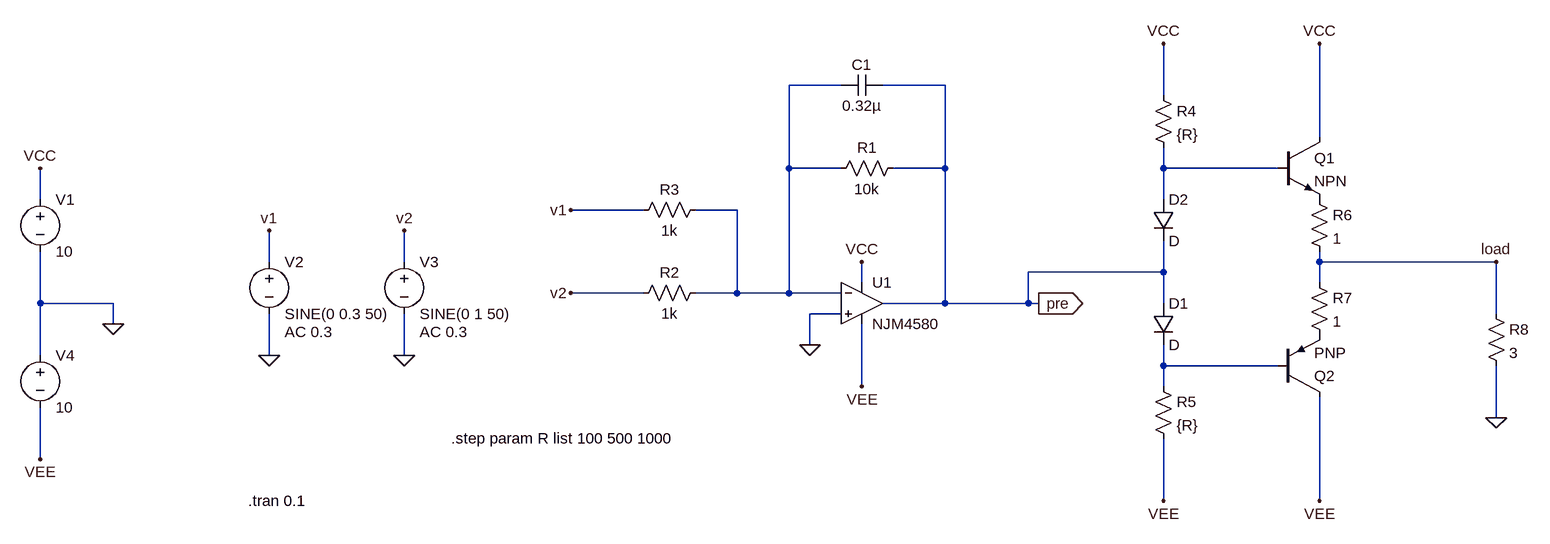
[diagram p0: schematic woofer_amp_coupling_capacitor.asc]
woofer_amp_coupling_capacitor.asc, the LTspice schematic file:
Version 4
SHEET 1 1160 680
WIRE 96 -192 16 -192
WIRE 256 -192 160 -192
WIRE 592 -176 592 -256
WIRE 832 -112 832 -256
WIRE 16 -64 16 -192
WIRE 96 -64 16 -64
WIRE 256 -64 256 -192
WIRE 256 -64 176 -64
WIRE 592 -64 592 -96
WIRE 768 -64 592 -64
WIRE -1136 -16 -1136 -64
WIRE 592 -16 592 -64
WIRE -208 0 -320 0
WIRE -64 0 -128 0
WIRE -784 80 -784 32
WIRE -576 80 -576 32
WIRE 832 80 832 64
WIRE 1104 80 832 80
WIRE 592 96 592 48
WIRE 592 96 384 96
WIRE 128 112 128 80
WIRE 832 112 832 80
WIRE -208 128 -320 128
WIRE -64 128 -64 0
WIRE -64 128 -128 128
WIRE 16 128 16 -64
WIRE 16 128 -64 128
WIRE 96 128 16 128
WIRE -1136 144 -1136 64
WIRE -1024 144 -1136 144
WIRE 256 144 256 -64
WIRE 256 144 160 144
WIRE 384 144 384 96
WIRE 384 144 256 144
WIRE 400 144 384 144
WIRE 592 144 592 96
WIRE 96 160 48 160
WIRE 1104 160 1104 80
WIRE -1024 176 -1024 144
WIRE 48 208 48 160
WIRE -1136 224 -1136 144
WIRE -784 224 -784 160
WIRE -576 224 -576 160
WIRE 592 240 592 208
WIRE 768 240 592 240
WIRE 128 272 128 176
WIRE 592 272 592 240
WIRE 1104 320 1104 240
WIRE -1136 384 -1136 304
WIRE 592 448 592 352
WIRE 832 448 832 288
FLAG 48 208 0
FLAG 400 144 pre
IOPIN 400 144 Out
FLAG -1136 -64 VCC
FLAG -1136 384 VEE
FLAG 128 80 VCC
FLAG 128 272 VEE
FLAG -784 32 v1
FLAG -576 32 v2
FLAG -576 224 0
FLAG -784 224 0
FLAG -320 0 v1
FLAG -320 128 v2
FLAG -1024 176 0
FLAG 592 -256 VCC
FLAG 592 448 VEE
FLAG 832 448 VEE
FLAG 832 -256 VCC
FLAG 1104 320 0
FLAG 1104 80 load
SYMBOL Opamps\\NJM4580 128 80 R0
SYMATTR InstName U1
SYMBOL cap 160 -208 R90
WINDOW 0 0 32 VBottom 2
WINDOW 3 32 32 VTop 2
SYMATTR InstName C1
SYMATTR Value 0.32µ
SYMBOL res 192 -80 R90
WINDOW 0 0 56 VBottom 2
WINDOW 3 32 56 VTop 2
SYMATTR InstName R1
SYMATTR Value 10k
SYMBOL res -112 112 R90
WINDOW 0 0 56 VBottom 2
WINDOW 3 32 56 VTop 2
SYMATTR InstName R2
SYMATTR Value 1k
SYMBOL res -112 -16 R90
WINDOW 0 0 56 VBottom 2
WINDOW 3 32 56 VTop 2
SYMATTR InstName R3
SYMATTR Value 1k
SYMBOL voltage -1136 -32 R0
WINDOW 123 0 0 Left 0
WINDOW 39 0 0 Left 0
SYMATTR InstName V1
SYMATTR Value 10
SYMBOL voltage -784 64 R0
WINDOW 123 24 124 Left 2
WINDOW 39 0 0 Left 0
SYMATTR Value2 AC 0.3
SYMATTR InstName V2
SYMATTR Value SINE(0 0.3 50)
SYMBOL voltage -576 64 R0
WINDOW 123 24 124 Left 2
WINDOW 39 0 0 Left 0
SYMATTR Value2 AC 0.3
SYMATTR InstName V3
SYMATTR Value SINE(0 1 50)
SYMBOL voltage -1136 208 R0
WINDOW 123 0 0 Left 0
WINDOW 39 0 0 Left 0
SYMATTR InstName V4
SYMATTR Value 10
SYMBOL diode 576 144 R0
SYMATTR InstName D1
SYMBOL diode 576 -16 R0
SYMATTR InstName D2
SYMBOL res 576 -192 R0
SYMATTR InstName R4
SYMATTR Value {R}
SYMBOL res 576 256 R0
SYMATTR InstName R5
SYMATTR Value {R}
SYMBOL npn 768 -112 R0
SYMATTR InstName Q1
SYMBOL pnp 768 288 M180
SYMATTR InstName Q2
SYMBOL res 816 -32 R0
SYMATTR InstName R6
SYMATTR Value 1
SYMBOL res 816 96 R0
SYMATTR InstName R7
SYMATTR Value 1
SYMBOL res 1088 144 R0
SYMATTR InstName R8
SYMATTR Value 3
TEXT -816 448 Left 2 !.tran 0.1
TEXT -504 352 Left 2 !.step param R list 100 500 1000

The netlist it stands for:
* woofer_amp_coupling_capacitor.asc
XU1 0 N001 VCC VEE pre NJM4580  ; pins In+ In- V+ V- OUT
C1 pre N001 0.32µ
R1 pre N001 10k
R2 N001 v2 1k
R3 N001 v1 1k
V1 VCC 0 10
V2 v1 0 SINE(0 0.3 50) AC 0.3
V3 v2 0 SINE(0 1 50) AC 0.3
V4 0 VEE 10
D1 pre N003 D
D2 N002 pre D
R4 VCC N002 {R}
R5 N003 VEE {R}
Q1 VCC N002 P001 0 NPN
Q2 VEE N003 P002 0 PNP
R6 P001 load 1
R7 load P002 1
R8 load 0 3
.model D D
.lib standard.dio
.model NPN NPN
.model PNP PNP
.lib standard.bjt
.tran 0.1
.step param R list 100 500 1000
.backanno
.end